# EAGLE design rony_helloEcho (EAGLE 8.0.2)
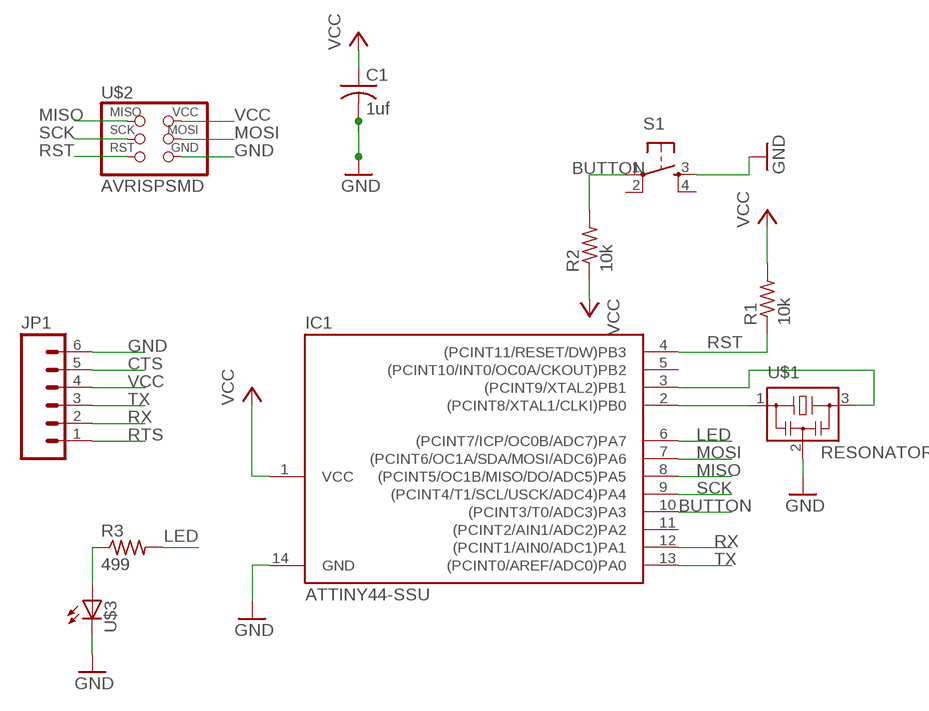
[diagram p0: schematic, sheet 1]

## Parts
C1  1uf  C-USC1206  [C1206]
IC1  ATTINY44-SSU  [SOIC14]
JP1  M06SMD  [1X06-SMD]
R1  10k  R-US_R1206  [R1206]
R2  10k  R-US_R1206  [R1206]
R3  499  RES-US1206FAB  [R1206FAB]
S1  6MM_SWITCH6MM_SWITCH  [6MM_SWITCH]
U$1  RESONATOR  [EFOBM]
U$2  AVRISPSMD  [2X03SMD]
U$3  LED1206  [1206]

## Nets
BUTTON: IC1.10((PCINT3/T0/ADC3)PA3) R2.2 S1.1(P)
CTS: JP1.5
GND: C1.2 IC1.14(GND) JP1.6 S1.3(S) U$1.2 U$2.6(GND) U$3.2(C)
LED: IC1.6((PCINT7/ICP/OC0B/ADC7)PA7) R3.2
MISO: IC1.8((PCINT5/OC1B/MISO/DO/ADC5)PA5) U$2.1(MISO)
MOSI: IC1.7((PCINT6/OC1A/SDA/MOSI/ADC6)PA6) U$2.4(MOSI)
N$1: IC1.2((PCINT8/XTAL1/CLKI)PB0) U$1.1
N$2: IC1.3((PCINT9/XTAL2)PB1) U$1.3
N$3: R3.1 U$3.1(A)
RST: IC1.4((PCINT11/RESET/DW)PB3) R1.1 U$2.5(RST)
RTS: JP1.1
RX: IC1.12((PCINT1/AIN0/ADC1)PA1) JP1.2
SCK: IC1.9((PCINT4/T1/SCL/USCK/ADC4)PA4) U$2.3(SCK)
TX: IC1.13((PCINT0/AREF/ADC0)PA0) JP1.3
VCC: C1.1 IC1.1(VCC) JP1.4 R1.2 R2.1 U$2.2(VCC)
Unconnected: IC1.5((PCINT10/INT0/OC0A/CKOUT)PB2) IC1.11((PCINT2/AIN1/ADC2)PA2) S1.2(P1) S1.4(S1)

## Library data of the parts
C1 = rcl:C-US: CAPACITOR, American symbol
IC1 = fab:ATTINY44
JP1 = SparkFun:M06: Header 6 Standard 6-pin 0.1" header. Use with straight break away headers (SKU : PRT-00116), right angle break away headers (PRT-00553), swiss pins (PRT-00743), machine pins (PRT-00117), and female headers (PRT-00115). Molex polarized connector foot print use with SKU : PRT-08094 with associated crimp pins and housings. NOTES ON THE VARIANTS LOCK and LOCK_LONGPADS... This footprint was designed to help hold the alignment of a through-hole component (i.e. 6-pin header) while soldering it into place. You may notice that each hole has been shifted either up or down by 0.005 of an inch from it's more standard position (which is a perfectly straight line). This slight alteration caused the pins (the squares in the middle) to touch the edges of the holes. Because they are alternating, it causes a "brace" to hold the component in place. 0.005 has proven to be the perfect amount of "off-center" position when using our standard breakaway headers. Although looks a little odd when you look at the bare footprint, once you have a header in there, the alteration is very hard to notice. Also, if you push a header all the way into place, it is covered up entirely on the bottom side. This idea of altering the position of holes to aid alignment will be further integrated into the Sparkfun Library for other footprints. It can help hold any component with 3 or more connection pins.
R1 R2 = resistor:R-US_: RESISTOR, American symbol
R3 = fab:RES-US: Resistor (US Symbol) Variants with postfix FAB are widened to allow the routing of internal traces
S1 = fab:6MM_SWITCH: OMRON SWITCH
U$1 = fab:RESONATOR
U$2 = fab:AVRISP
U$3 = ng:LED

## Board
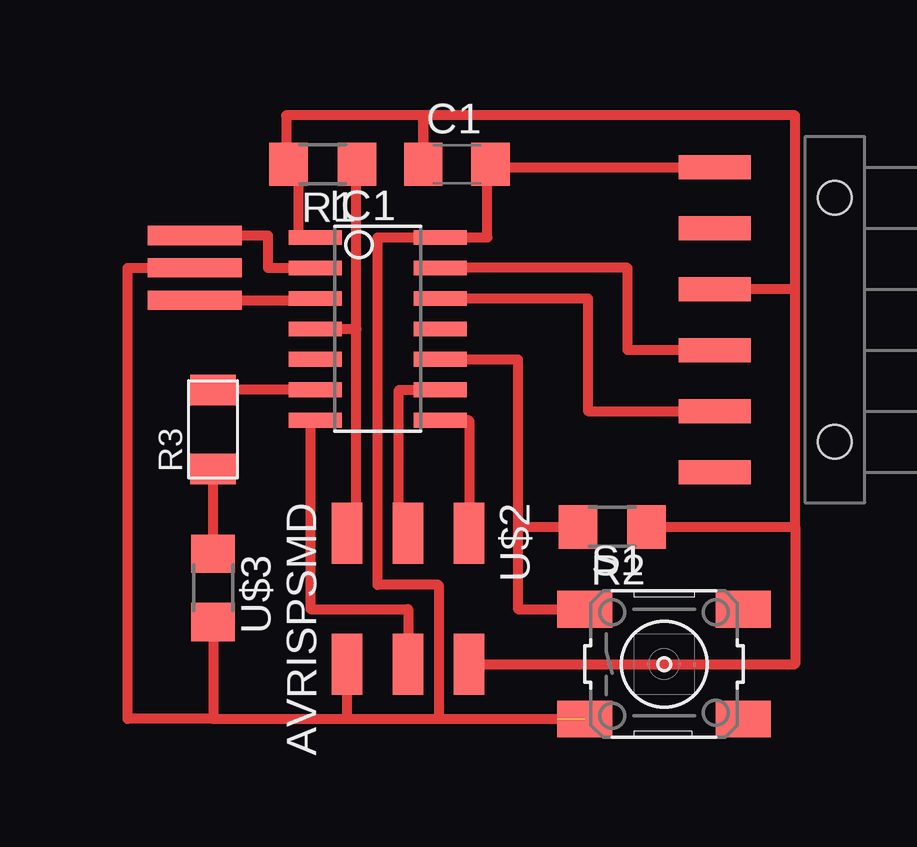
[diagram p1: board, top side]
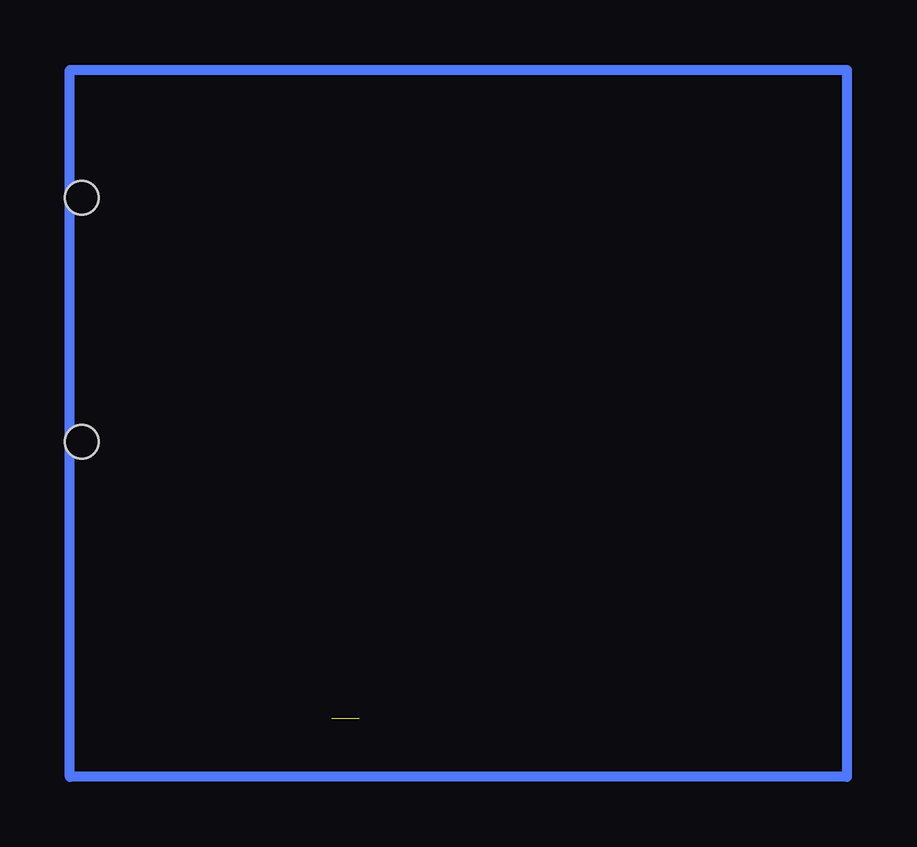
[diagram p2: board, bottom side, seen from below]

No outline drawn. Coordinates in mm, seen from the top.
Copper layers 1: Top 0.035mm
Design rules "ERP-1sided-10mil-16mill": minimum track width 10mil, minimum drill 24mil, track to track 16mil, track to pad 16mil, pad to pad 16mil, via to via 16mil, smd to smd 0mil, copper to edge 16mil, drill to drill 36mil, minimum pad ring 10mil, minimum via ring 8mil, stop-mask expansion 4mil, vias tented up to drill 0mil, thermal gap 10mil

### Footprints (pad centres in the part's own frame; a part is rotated, then mirrored left to right if it is on the bottom)
C1206 = smd 1.6 x 1.8: 1 -1.4,0; 2 1.4,0
SOIC14 = smd 0.61 x 2.21: 1 -3.81,-2.603; 2 -2.54,-2.603; 3 -1.27,-2.603; 4 0,-2.603; 5 1.27,-2.603; 6 2.54,-2.603; 7 3.81,-2.603; 8 3.81,2.603; 9 2.54,2.603; 10 1.27,2.603; 11 0,2.603; 12 -1.27,2.603; 13 -2.54,2.603; 14 -3.81,2.603
1X06-SMD = smd 1 x 3: 1 -6.35,5; 2 -3.81,5; 3 -1.27,5; 4 1.27,5; 5 3.81,5; 6 6.35,5 | hole 1.4: -5.08,0; 5.08,0
R1206 = smd 1.6 x 1.803: 1 -1.422,0; 2 1.422,0
R1206FAB = smd 1.27 x 1.905: 1 -1.651,0; 2 1.651,0
6MM_SWITCH = smd 2.286 x 1.524: 1 -3.302,2.286; 2 3.302,2.286; 3 -3.302,-2.286; 4 3.302,-2.286
EFOBM = smd 0.8 x 3.9: 1 -1.35,0; 2 0,0; 3 1.35,0
2X03SMD = smd 2.54 x 1.27: 1 -2.54,2.54; 2 2.92,2.54; 3 -2.54,0; 4 2.92,0; 5 -2.54,-2.54; 6 2.92,-2.54
1206 = smd 1.6 x 1.803: 1 -1.422,0; 2 1.422,0

### Placement (x,y rotation side)
C1  16.26,25.78 0 top
IC1  12.95,18.92 270 top
JP1  32,19.3 90 top
R1  10.67,25.78 180 top
R2  22.73,10.67 180 top
R3  6.1,14.73 90 top
S1  24.89,4.95 0 top
U$1  5.33,21.46 270 top
U$2  14.22,7.87 270 top
U$3  6.1,8.13 270 top

### Tracks (layer width: path | path; a pad name or v marks a point on that pad's centre or on a via)
BUTTON
  Top 0.406: IC1.10 18.8,17.65 18.8,10.67 | 18.8,10.67 18.8,7.24 S1.1 | 18.8,10.67 R2.2
GND  (1 unrouted)
  Top 0.406: 15.49,2.67 15.49,8.26 12.95,8.26 12.95,22.73 IC1.14 17.53,22.73 17.53,25.78 C1.2 17.66,25.65 JP1.6 | 11.68,2.67 15.49,2.67 | U$1.2 2.54,21.46 2.54,2.67 6.1,2.67 | 11.68,5.84 U$2.6 11.68,2.67 | 6.1,2.67 11.68,2.67 | U$3.2 6.1,2.67 | 15.49,2.67 20.45,2.67
LED
  Top 0.406: IC1.6 R3.2
MISO
  Top 0.406: IC1.8 16.76,15.11 U$2.1
MOSI
  Top 0.406: IC1.7 10.16,15.11 10.16,7.24 14.22,7.24 U$2.4
N$1
  Top 0.406: U$1.1 8.38,22.81 8.38,21.46 IC1.2
N$2
  Top 0.406: U$1.3 10.35,20.11 IC1.3
N$3
  Top 0.406: U$3.1 R3.1
N$4
  Bottom 0.406: 0.13,0.25 32.51,0.25 32.51,29.72 0.13,29.72 0.13,0.25
RST
  Top 0.406: R1.1 12.06,25.78 12.06,18.92 | IC1.4 12.06,18.92 | U$2.5 12.06,11.3 12.06,18.92
RX
  Top 0.406: IC1.12 21.72,20.19 21.72,15.49 JP1.2
SCK
  Top 0.406: U$2.3 13.84,11.3 13.84,16.38 IC1.9
TX
  Top 0.406: JP1.3 23.37,18.03 23.37,21.46 IC1.13
VCC
  Top 0.406: 30.35,20.57 JP1.4 | 30.35,10.67 30.35,4.95 U$2.2 | 30.35,10.67 30.35,20.57 | IC1.1 9.65,22.73 9.65,25.78 R1.2 9.14,25.78 9.14,27.81 14.86,27.81 C1.1 14.86,27.81 30.35,27.81 30.35,20.57 | R2.1 30.35,10.67